# Altium schematic sheet Others.SchDoc
size A3; SheetNumber: 8; SheetTotal: 9
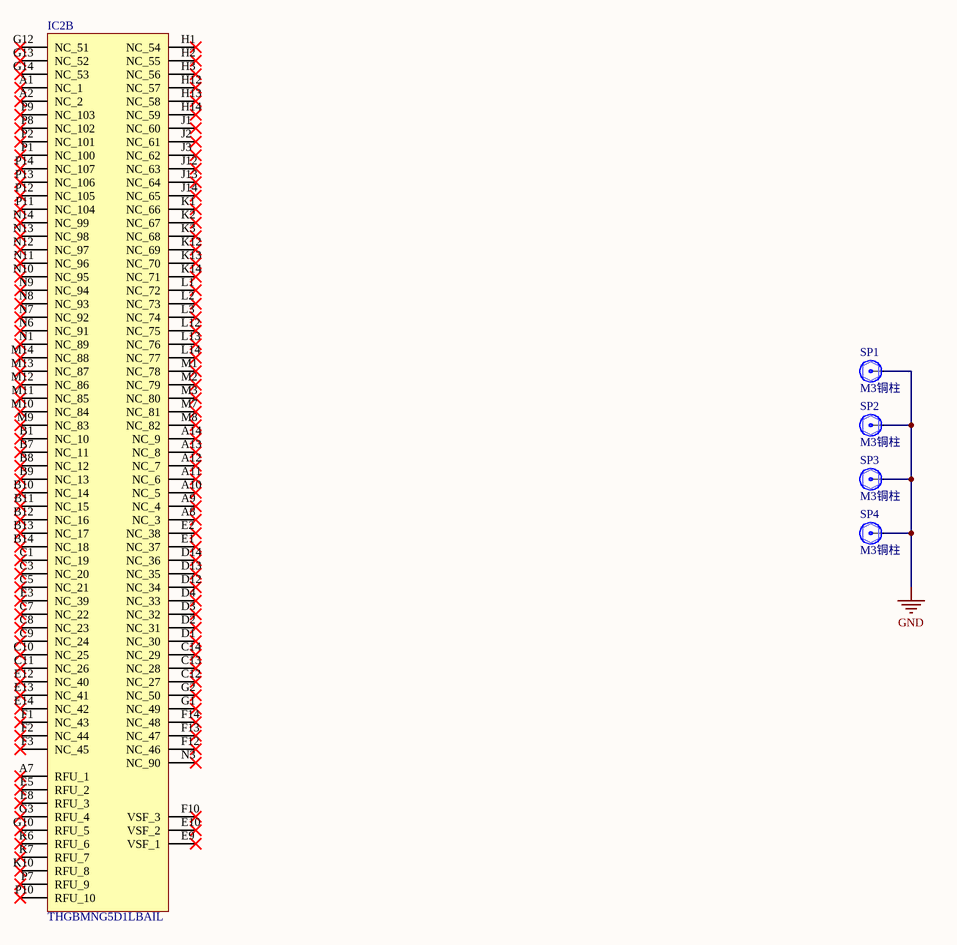
[diagram p0: Others.SchDoc]

## Parts
IC2  THGBMNG5D1LBAIL  [BGA153C50P14X14_1150X1300X80]  (part B of 2)
SP1  M3铜柱  [M3x4+6_L]
SP2  M3铜柱  [M3x4+6_L]
SP3  M3铜柱  [M3x4+6_L]
SP4  M3铜柱  [M3x4+6_L]

## Nets
GND: SP1.1 SP2.1 SP3.1 SP4.1

Not connected (* = marked no-connect by the designer): IC2 A1(NC_1)* A2(NC_2)* A7(RFU_1)* A8(NC_3)* A9(NC_4)* A10(NC_5)* A11(NC_6)* A12(NC_7)* A13(NC_8)* A14(NC_9)* B1(NC_10)* B7(NC_11)* B8(NC_12)* B9(NC_13)* B10(NC_14)* B11(NC_15)* B12(NC_16)* B13(NC_17)* B14(NC_18)* C1(NC_19)* C3(NC_20)* C5(NC_21)* C7(NC_22)* C8(NC_23)* C9(NC_24)* C10(NC_25)* C11(NC_26)* C12(NC_27)* C13(NC_28)* C14(NC_29)* D1(NC_30)* D2(NC_31)* D3(NC_32)* D4(NC_33)* D12(NC_34)* D13(NC_35)* D14(NC_36)* E1(NC_37)* E2(NC_38)* E3(NC_39)* E5(RFU_2)* E8(RFU_3)* E9(VSF_1)* E10(VSF_2)* E12(NC_40)* E13(NC_41)* E14(NC_42)* F1(NC_43)* F2(NC_44)* F3(NC_45)* F10(VSF_3)* F12(NC_46)* F13(NC_47)* F14(NC_48)* G1(NC_49)* G2(NC_50)* G3(RFU_4)* G10(RFU_5)* G12(NC_51)* G13(NC_52)* G14(NC_53)* H1(NC_54)* H2(NC_55)* H3(NC_56)* H12(NC_57)* H13(NC_58)* H14(NC_59)* J1(NC_60)* J2(NC_61)* J3(NC_62)* J12(NC_63)* J13(NC_64)* J14(NC_65)* K1(NC_66)* K2(NC_67)* K3(NC_68)* K6(RFU_6)* K7(RFU_7)* K10(RFU_8)* K12(NC_69)* K13(NC_70)* K14(NC_71)* L1(NC_72)* L2(NC_73)* L3(NC_74)* L12(NC_75)* L13(NC_76)* L14(NC_77)* M1(NC_78)* M2(NC_79)* M3(NC_80)* M7(NC_81)* M8(NC_82)* M9(NC_83)* M10(NC_84)* M11(NC_85)* M12(NC_86)* M13(NC_87)* M14(NC_88)* N1(NC_89)* N3(NC_90)* N6(NC_91)* N7(NC_92)* N8(NC_93)* N9(NC_94)* N10(NC_95)* N11(NC_96)* N12(NC_97)* N13(NC_98)* N14(NC_99)* P1(NC_100)* P2(NC_101)* P7(RFU_9)* P8(NC_102)* P9(NC_103)* P10(RFU_10)* P11(NC_104)* P12(NC_105)* P13(NC_106)* P14(NC_107)*

## Library data of the parts
IC2 = THGBMNG5D1LBAIL: Integrated Circuit; Manufacturer_Name: Toshiba; Datasheet Link: https://datasheet.lcsc.com/szlcsc/1906131632_TOSHIBA-THGBMNG5D1LBAIL_C391255.pdf; Height: 0.8mm; Manufacturer_Part_Number: THGBMNG5D1LBAIL; Mouser Part Number: N/A; Mouser Price/Stock: https://www.mouser.co.uk/ProductDetail/Toshiba/THGBMNG5D1LBAIL?qs=Znm5pLBrcAKyiWgFGEjr8Q%3D%3D
SP1-SP4 = 铜柱加头小焊盘: 铜柱; 联系下单店铺卖家 免费技术支持: 联系下单店铺卖家 免费帮你查找封装; BOM名称: 铜柱